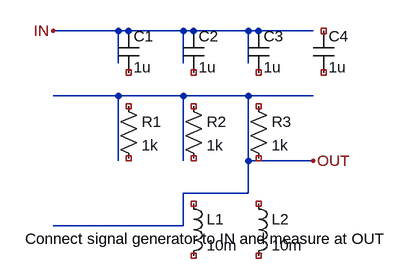
[diagram p0: schematic com_ckt_DUT.asc]
com_ckt_DUT.asc, the LTspice schematic file:
Version 4
SHEET 1 880 680
WIRE 0 0 100 0
WIRE 100 0 200 0
WIRE 200 0 300 0
WIRE 300 0 400 0
WIRE 100 50 100 0
WIRE 200 50 200 0
WIRE 300 50 300 0
WIRE 0 100 100 100
WIRE 100 100 200 100
WIRE 200 100 300 100
WIRE 300 100 400 100
WIRE 100 150 100 100
WIRE 200 150 200 100
WIRE 300 150 300 100
WIRE 100 200 100 150
WIRE 200 200 200 150
WIRE 300 200 300 150
WIRE 400 200 300 200
WIRE 300 250 300 200
WIRE 200 250 300 250
WIRE 200 300 200 250
WIRE 100 300 200 300
WIRE 100 300 0 300
FLAG 0 0 IN
FLAG 400 200 OUT
SYMBOL cap 100 0 R0
SYMATTR InstName C1
SYMATTR Value 1u
SYMBOL cap 200 0 R0
SYMATTR InstName C2
SYMATTR Value 1u
SYMBOL cap 300 0 R0
SYMATTR InstName C3
SYMATTR Value 1u
SYMBOL cap 400 0 R0
SYMATTR InstName C4
SYMATTR Value 1u
SYMBOL res 100 100 R0
SYMATTR InstName R1
SYMATTR Value 1k
SYMBOL res 200 100 R0
SYMATTR InstName R2
SYMATTR Value 1k
SYMBOL res 300 100 R0
SYMATTR InstName R3
SYMATTR Value 1k
SYMBOL ind 200 250 R0
SYMATTR InstName L1
SYMATTR Value 10m
SYMBOL ind 300 250 R0
SYMATTR InstName L2
SYMATTR Value 10m
TEXT -50 320 Left 2 ! Connect signal generator to IN and measure at OUT

The netlist it stands for:
* com_ckt_DUT.asc
C1 IN NC_01 1u
C2 IN NC_02 1u
C3 IN NC_03 1u
C4 NC_04 NC_05 1u
R1 NC_06 NC_07 1k
R2 NC_08 NC_09 1k
R3 NC_10 NC_11 1k
L1 NC_12 NC_13 10m
L2 NC_14 NC_15 10m
 Connect signal generator to IN and measure at OUT
.backanno
.end